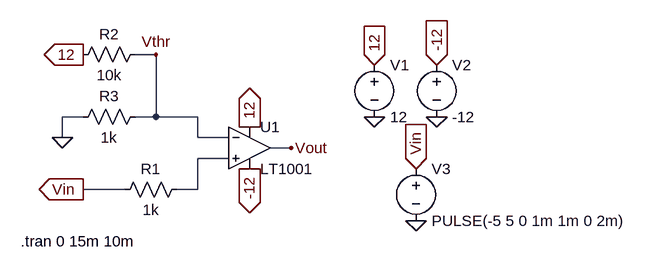
[diagram p0: schematic lab8.1.1.asc]
lab8.1.1.asc, the LTspice schematic file:
Version 4
SHEET 1 880 680
WIRE 16 0 -16 0
WIRE -96 96 -128 96
WIRE 16 96 16 0
WIRE 16 96 -16 96
WIRE 80 96 16 96
WIRE -128 128 -128 96
WIRE 80 128 80 96
WIRE 128 128 80 128
WIRE 224 144 192 144
WIRE 128 160 80 160
WIRE -32 208 -96 208
WIRE 80 208 80 160
WIRE 80 208 48 208
FLAG 352 96 0
FLAG 448 96 0
FLAG 352 16 12
IOPIN 352 16 In
FLAG 160 112 12
IOPIN 160 112 Out
FLAG 448 16 -12
IOPIN 448 16 In
FLAG 160 176 -12
IOPIN 160 176 Out
FLAG 16 0 Vthr
FLAG -128 128 0
FLAG -96 0 12
IOPIN -96 0 Out
FLAG 416 176 Vin
IOPIN 416 176 In
FLAG -96 208 Vin
IOPIN -96 208 Out
FLAG 416 256 0
FLAG 224 144 Vout
SYMBOL Opamps\\LT1001 160 80 R0
SYMATTR InstName U1
SYMBOL voltage 352 0 R0
SYMATTR InstName V1
SYMATTR Value 12
SYMBOL voltage 448 0 R0
SYMATTR InstName V2
SYMATTR Value -12
SYMBOL res 64 192 R90
WINDOW 0 0 56 VBottom 2
WINDOW 3 32 56 VTop 2
SYMATTR InstName R1
SYMATTR Value 1k
SYMBOL res 0 -16 R90
WINDOW 0 0 56 VBottom 2
WINDOW 3 32 56 VTop 2
SYMATTR InstName R2
SYMATTR Value 10k
SYMBOL res 0 80 R90
WINDOW 0 0 56 VBottom 2
WINDOW 3 32 56 VTop 2
SYMATTR InstName R3
SYMATTR Value 1k
SYMBOL voltage 416 160 R0
WINDOW 123 0 0 Left 0
WINDOW 39 0 0 Left 0
SYMATTR InstName V3
SYMATTR Value PULSE(-5 5 0 1m 1m 0 2m)
TEXT -192 288 Left 2 !.tran 0 15m 10m

The netlist it stands for:
* lab8.1.1.asc
XU1 N001 Vthr 12 -12 Vout LT1001  ; pins In+ In- V+ V- OUT
V1 12 0 12
V2 -12 0 -12
R1 N001 Vin 1k
R2 Vthr 12 10k
R3 Vthr 0 1k
V3 Vin 0 PULSE(-5 5 0 1m 1m 0 2m)
.tran 0 15m 10m
.lib LTC.lib
.backanno
.end